# EAGLE design final v1 (EAGLE 7.7.0)
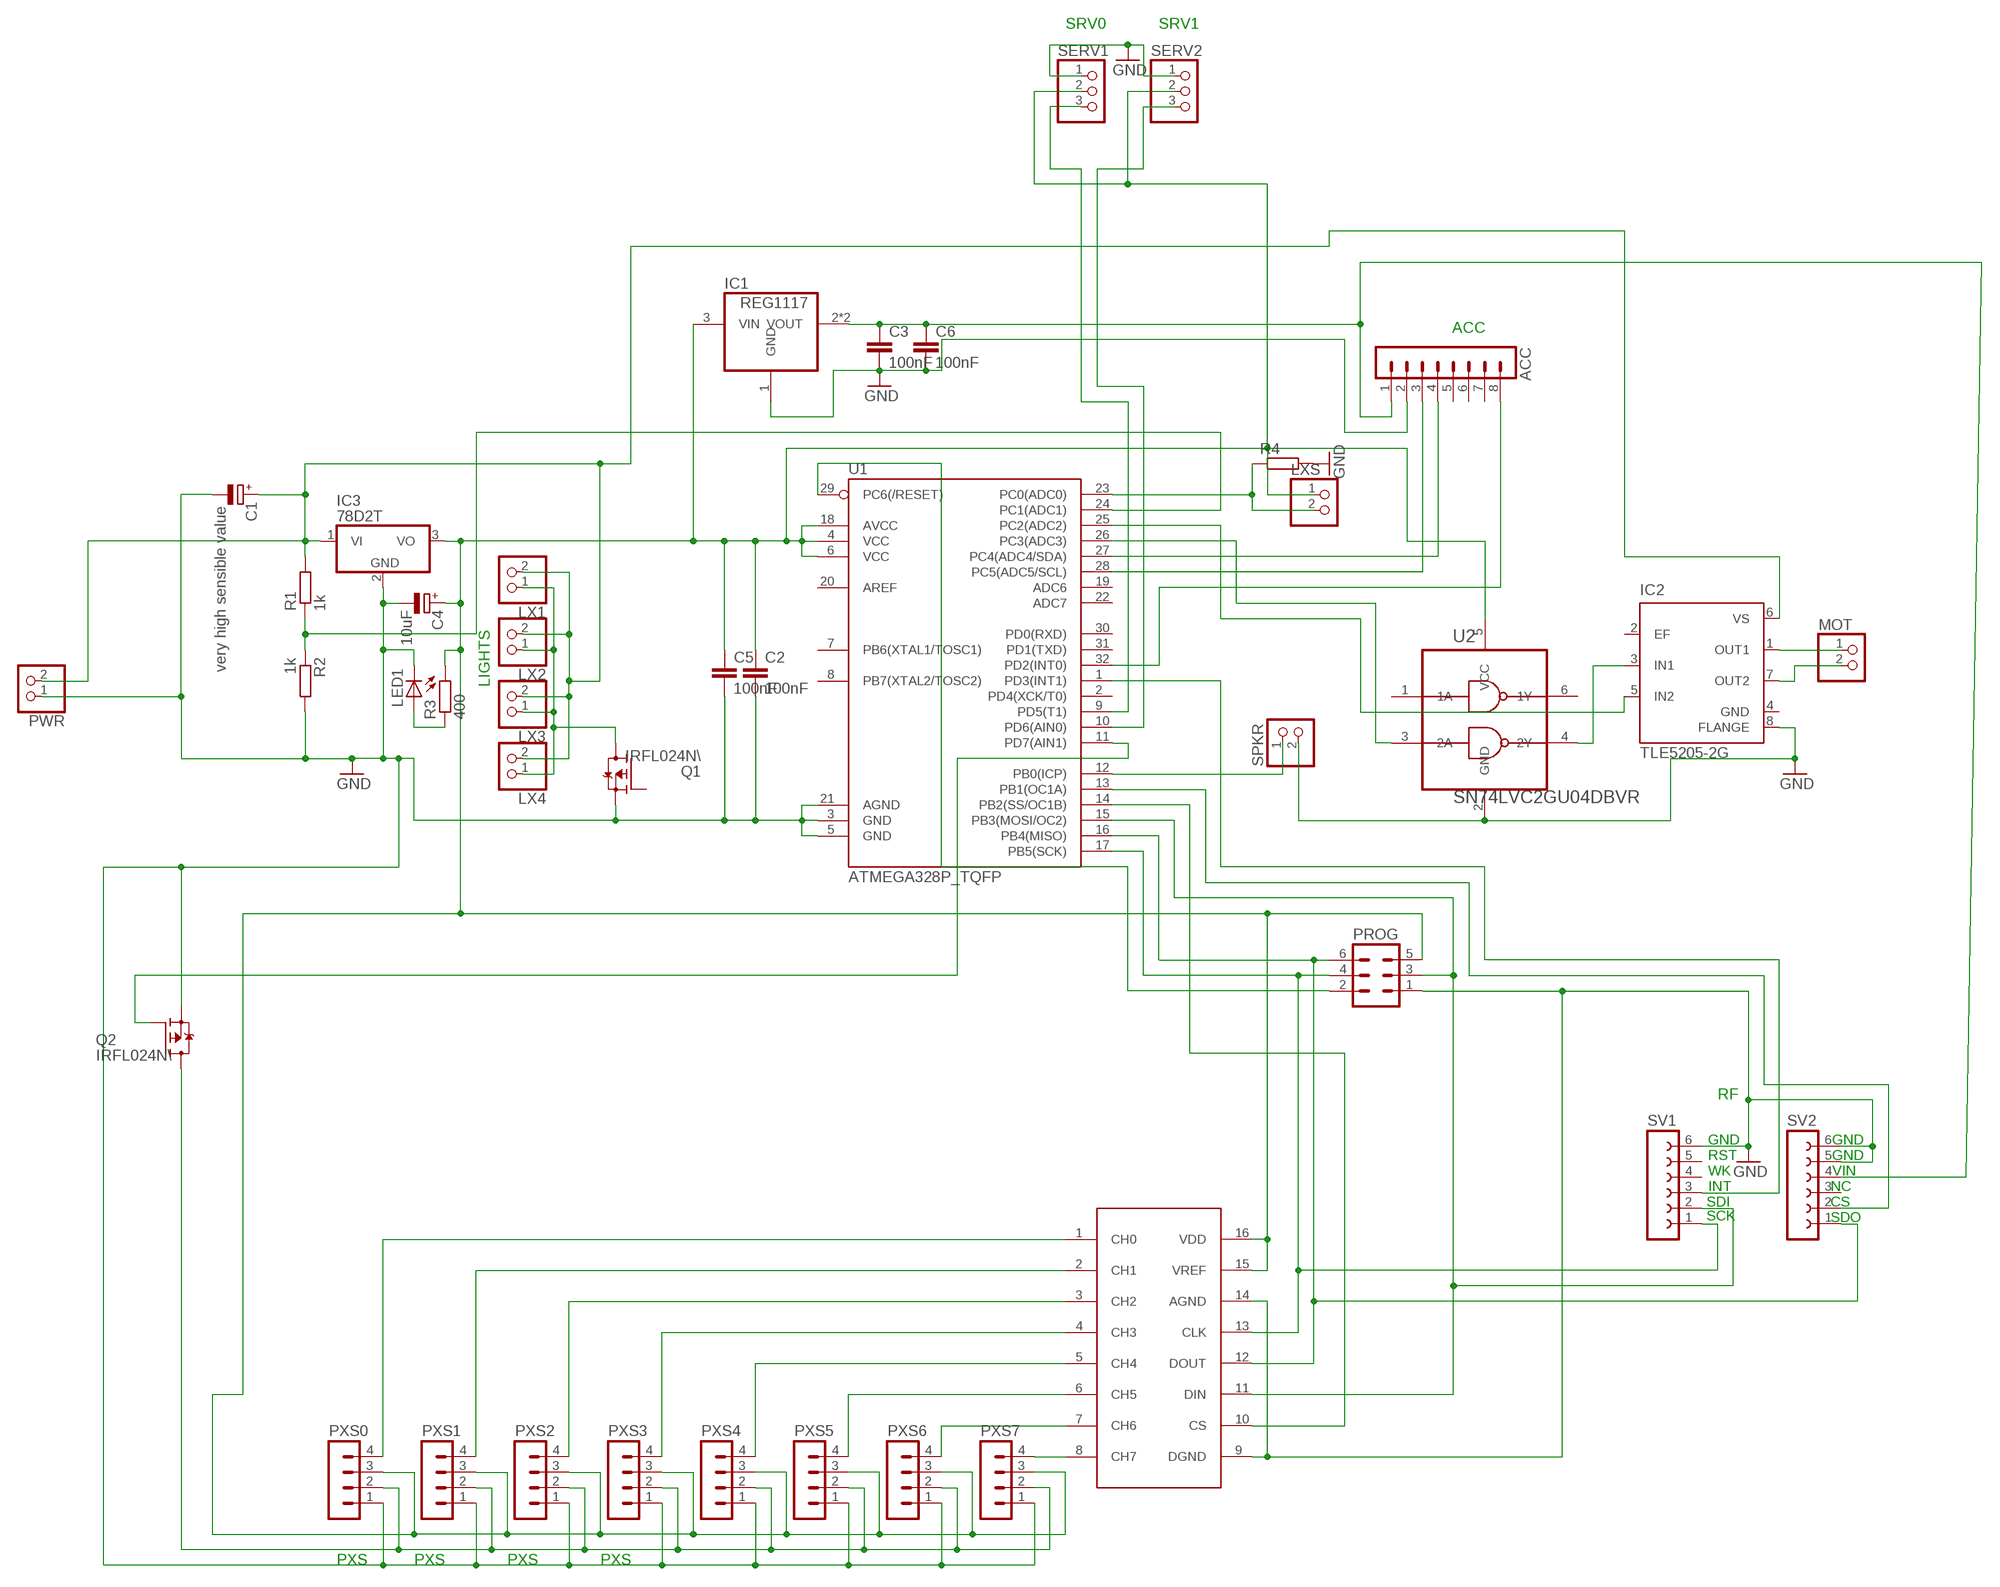
[diagram p0: schematic, sheet 1]

## Parts
ACC  MA08-1  [MA08-1]
C1  very high sensible value  CPOL-EUE2.5-7  [E2,5-7]
C2  100nF  C-EUC1206  [C1206]
C3  100nF  C-EUC1206  [C1206]
C4  10uF  CPOL-EU153CLV-0505  [153CLV-0505]
C5  100nF  C-EUC1206  [C1206]
C6  100nF  C-EUC1206  [C1206]
IC1  REG1117  [SOT223]
IC2  TLE5205-2G  [P-TO263-7-1]
IC3  78D2T  [D2PACK]
LED1  LEDCHIPLED_0603  [CHIPLED_0603]
LX1  PINHD-1X2  [1X02]
LX2  PINHD-1X2  [1X02]
LX3  PINHD-1X2  [1X02]
LX4  PINHD-1X2  [1X02]
LXS  PINHD-1X2  [1X02]
MOT  PINHD-1X2  [1X02]
PROG  MA03-2  [MA03-2]
PWR  PINHD-1X2  [1X02]
PXS0  MA04-1  [MA04-1]
PXS1  MA04-1  [MA04-1]
PXS2  MA04-1  [MA04-1]
PXS3  MA04-1  [MA04-1]
PXS4  MA04-1  [MA04-1]
PXS5  MA04-1  [MA04-1]
PXS6  MA04-1  [MA04-1]
PXS7  MA04-1  [MA04-1]
Q1  IRFL024N\  BSP170P  [SOT223]
Q2  IRFL024N\  BSP170P  [SOT223]
R1  1k  R-EU_M1206  [M1206]
R2  1k  R-EU_R1206  [R1206]
R3  400  R-EU_R0603  [R0603]
R4  R-EU_M1206  [M1206]
SERV1  PINHD-1X3  [1X03]
SERV2  PINHD-1X3  [1X03]
SPKR  PINHD-1X2  [1X02]
SV1  FE06-1  [FE06]
SV2  FE06-1  [FE06]
U1  ATMEGA328P_TQFP  [TQFP32-08]
U2  SN74LVC2GU04DBVR  [SOT95P280X145-6N]
U$3  MCP3208  [SO-16]

## Nets
GND: ACC.2 C1.- C2.2 C3.2 C4.- C5.2 C6.2 IC1.1(GND) IC2.8(FLANGE) IC3.2(GND) LED1.C PROG.1 PWR.1 PXS0.1 PXS1.1 PXS2.1 PXS3.1 PXS4.1 PXS5.1 PXS6.1 PXS7.1 Q1.3(S) Q2.3(S) R2.2 R4.2 SERV1.1 SERV2.1 SPKR.2 SV1.6 SV2.5 SV2.6 U1.3(GND) U1.5(GND) U1.21(AGND) U2.2(GND) U$3.9(DGND) U$3.14(AGND)
MISO: PROG.6 SV2.1 U1.16(PB4(MISO)) U$3.12(DOUT)
MOSI: PROG.3 SV1.2 U1.15(PB3(MOSI/OC2)) U$3.11(DIN)
N$1: SPKR.1 U1.12(PB0(ICP))
N$2: LX1.1 LX2.1 LX3.1 LX4.1 Q1.2(D) Q1.4(D)
N$3: U1.14(PB2(SS/OC1B)) U$3.10(CS)
N$5: ACC.8 U1.32(PD2(INT0))
N$6: PXS7.4 U$3.8(CH7)
N$7: IC2.1(OUT1) MOT.1
N$8: PXS6.4 U$3.7(CH6)
N$9: PXS5.4 U$3.6(CH5)
N$10: SV2.2 U1.13(PB1(OC1A))
N$11: PXS4.4 U$3.5(CH4)
N$12: PXS3.4 U$3.4(CH3)
N$13: PXS2.4 U$3.3(CH2)
N$14: PXS1.4 U$3.2(CH1)
N$15: SV1.3 U1.1(PD3(INT1))
N$16: PXS0.4 U$3.1(CH0)
N$17: ACC.3 U1.28(PC5(ADC5/SCL))
N$18: LXS.2 R4.1 U1.23(PC0(ADC0))
N$19: Q2.1(G) U1.11(PD7(AIN1))
N$20: PXS0.2 PXS1.2 PXS2.2 PXS3.2 PXS4.2 PXS5.2 PXS6.2 PXS7.2 Q2.2(D) Q2.4(D)
N$21: ACC.4 U1.27(PC4(ADC4/SDA))
N$22: IC2.7(OUT2) MOT.2
N$23: IC2.3(IN1) U2.4(2Y)
N$24: U1.26(PC3(ADC3)) U2.3(2A)
N$25: IC2.5(IN2) U1.25(PC2(ADC2))
N$26: LED1.A R3.1
N$31: SERV1.3 U1.9(PD5(T1))
N$34: SERV2.3 U1.10(PD6(AIN0))
RST: PROG.2 U1.29(PC6(/RESET))
SCK: PROG.4 SV1.1 U1.17(PB5(SCK)) U$3.13(CLK)
VBATT: R1.1 R2.1 U1.24(PC1(ADC1))
VCC: C2.1 C4.+ C5.1 IC1.3(VIN) IC3.3(VO) LXS.1 PROG.5 PXS0.3 PXS1.3 PXS2.3 PXS3.3 PXS4.3 PXS5.3 PXS6.3 PXS7.3 R3.2 SERV1.2 SERV2.2 U1.4(VCC) U1.6(VCC) U1.18(AVCC) U2.5(VCC) U$3.15(VREF) U$3.16(VDD)
VCC2: ACC.1 C3.1 C6.1 IC1.2(VOUT) IC1.4(VOUT) SV2.4
VSS: C1.+ IC2.6(VS) IC3.1(VI) LX1.2 LX2.2 LX3.2 LX4.2 PWR.2 R1.2
Unconnected: ACC.5 ACC.6 ACC.7 IC2.2(EF) Q1.1(G) SV1.4 SV1.5 SV2.3 U1.2(PD4(XCK/T0)) U1.7(PB6(XTAL1/TOSC1)) U1.8(PB7(XTAL2/TOSC2)) U1.19(ADC6) U1.20(AREF) U1.22(ADC7) U1.30(PD0(RXD)) U1.31(PD1(TXD)) U2.1(1A) U2.6(1Y)

## Notes on the sheet
- SRV0 | SRV1
- ACC
- LIGHTS
- RF
- GND | GND
- RST | GND
- WK | VIN
- INT | NC
- SDI | CS
- SCK | SDO
- PXS | PXS | PXS | PXS

## Power pins joined to a net without a drawn wire
GND: IC2.4(GND)

## Library data of the parts
ACC = con-lstb:MA08-1: PIN HEADER; OC_FARNELL: unknown; OC_NEWARK: unknown
C1 C4 = rcl:CPOL-EU: POLARIZED CAPACITOR, European symbol
C2 C3 C5 C6 = rcl:C-EU: CAPACITOR, European symbol
IC1 = burr-brown:REG1117: 800mA and 1A Low Dropout (LDO) Positive Regulator 1.8V, 2.5V, 2.85V, 3.3V, 5V, and Adj; MPN: REG1117; OC_FARNELL: 1097566; OC_NEWARK: 14P6981
IC2 = infineon:TLE5205-2: 5-A H-Bridge for DC-Motor Applications Source: http://www.infineon.com .. tle5205-2.pdf; OC_FARNELL: unknown; OC_NEWARK: unknown
IC3 = custom:78*: Positive VOLTAGE REGULATOR Source: http://cache.national.com/ds/LM/LM78L05.pdf http://www.fairchildsemi.com/ds/LM/LM7805.pdf
LED1 = led:LED: LED OSRAM: - CHIPLED LG R971, LG N971, LY N971, LG Q971, LY Q971, LO R971, LY R971 LH N974, LH R974 LS Q976, LO Q976, LY Q976 LO Q996 - Hyper CHIPLED LW Q18S LB Q993, LB Q99A, LB R99A - SideLED LS A670, LO A670, LY A670, LG A670, LP A670 LB A673, LV A673, LT A673, LW A673 LH A674 LY A675 LS A676, LA A676, LO A676, LY A676, LW A676 LS A679, LY A679, LG A679 - Hyper Micro SIDELED® LS Y876, LA Y876, LO Y876, LY Y876 LT Y87S - SmartLED LW L88C, LW L88S LB L89C, LB L89S, LG L890 LS L89K, LO L89K, LY L89K LS L896, LA L896, LO L896, LY L896 - TOPLED LS T670, LO T670, LY T670, LG T670, LP T670 LSG T670, LSP T670, LSY T670, LOP T670, LYG T670 LG T671, LOG T671, LSG T671 LB T673, LV T673, LT T673, LW T673 LH T674 LS T676, LA T676, LO T676, LY T676, LB T676, LH T676, LSB T676, LW T676 LB T67C, LV T67C, LT T67C, LS T67K, LO T67K, LY T67K, LW E67C LS E67B, LA E67B, LO E67B, LY E67B, LB E67C, LV E67C, LT E67C LW T67C LS T679, LY T679, LG T679 LS T770, LO T770, LY T770, LG T770, LP T770 LB T773, LV T773, LT T773, LW T773 LH T774 LS E675, LA E675, LY E675, LS T675 LS T776, LA T776, LO T776, LY T776, LB T776 LHGB T686 LT T68C, LB T68C - Hyper Mini TOPLED® LB M676 - Mini TOPLED Santana® LG M470 LS M47K, LO M47K, LY M47K Source: http://www.osram.convergy.de LUXEON: - LUMILED® LXK2-PW12-R00, LXK2-PW12-S00, LXK2-PW14-U00, LXK2-PW14-V00 LXK2-PM12-R00, LXK2-PM12-S00, LXK2-PM14-U00 LXK2-PE12-Q00, LXK2-PE12-R00, LXK2-PE12-S00, LXK2-PE14-T00, LXK2-PE14-U00 LXK2-PB12-K00, LXK2-PB12-L00, LXK2-PB12-M00, LXK2-PB14-N00, LXK2-PB14-P00, LXK2-PB14-Q00 LXK2-PR12-L00, LXK2-PR12-M00, LXK2-PR14-Q00, LXK2-PR14-R00 LXK2-PD12-Q00, LXK2-PD12-R00, LXK2-PD12-S00 LXK2-PH12-R00, LXK2-PH12-S00 LXK2-PL12-P00, LXK2-PL12-Q00, LXK2-PL12-R00 Source: www.luxeon.com KINGBRIGHT: KA-3528ASYC Source: www.kingbright.com
LX1-LX4 LXS MOT PWR SPKR = pinhead:PINHD-1X2: PIN HEADER
PROG = con-lstb:MA03-2: PIN HEADER; OC_FARNELL: unknown; OC_NEWARK: unknown
PXS0 PXS1-PXS7 = custom:MA04-1: PIN HEADER; OC_FARNELL: unknown; OC_NEWARK: unknown
Q1 Q2 = transistor-fet:BSP170P: SIPMOS(R) Small-Signal-Transistor P-Channel, Enhancement mode Source: http://www.infineon.com/upload/Document/BSP170P_Rev2.4.pdf
R1-R4 = resistor:R-EU_: RESISTOR, European symbol
SERV1 SERV2 = pinhead:PINHD-1X3: PIN HEADER
SV1 SV2 = con-lsta:FE06-1: FEMALE HEADER; OC_FARNELL: unknown; OC_NEWARK: unknown
U1 = SparkFun-IC-Microcontroller:ATMEGA328P_TQFP: Popular 328P in QFP Storefront component: ATmega328 - TQFP <https://www.sparkfun.com/products/13448> (COM-13448) Datasheet <http://www.sparkfun.com/datasheets/Components/SMD/ATMega328.pdf> SparkFun Products SparkFun RedBoard - Programmed with Arduino <https://www.sparkfun.com/products/12757> (DEV-12757) Arduino Pro Mini 328 - 5V/16MHz <https://www.sparkfun.com/products/11113> (DEV-11113) Arduino Pro Mini 328 - 3.3V/8MHz <https://www.sparkfun.com/products/11114> (DEV-11114) SparkFun OpenLog <https://www.sparkfun.com/products/13712> (DEV-13712) SparkFun MicroView - OLED Arduino Module <https://www.sparkfun.com/products/12923> (DEV-12923) SparkFun Digital Sandbox <https://www.sparkfun.com/products/12651> (DEV-12651) SparkFun PicoBoard <https://www.sparkfun.com/products/11888> (WIG-11888) Arduino Fio <https://www.sparkfun.com/products/10116> (DEV-10116) LilyPad Arduino 328 Main Board <https://www.sparkfun.com/products/13342> (DEV-13342) SparkFun RedStick <https://www.sparkfun.com/products/13741> (DEV-13741) LilyPad MP3 <https://www.sparkfun.com/products/11013> (DEV-11013) LilyPad Arduino SimpleSnap <https://www.sparkfun.com/products/10941> (DEV-10941) SparkFun Stepoko <https://www.sparkfun.com/products/13899> (ROB-13899) SparkFun Geiger Counter <https://www.sparkfun.com/products/11345> (SEN-11345) SparkFun EL Sequencer <https://www.sparkfun.com/products/12781> (COM-12781) Arduino Pro 328 - 5V/16MHz <https://www.sparkfun.com/products/10915> (DEV-10915) CryptoCape <https://www.sparkfun.com/products/12773> (DEV-12773) SparkFun IR Thermometer Evaluation Board - MLX90614 <https://www.sparkfun.com/products/10740> (SEN-10740) SparkFun RedBot Mainboard <https://www.sparkfun.com/products/12097> (ROB-12097) Arduino Pro 328 - 3.3V/8MHz <https://www.sparkfun.com/products/10914> (DEV-10914) SparkFun Block for Intel® Edison - Arduino <https://www.sparkfun.com/products/13036> (DEV-13036) SparkFun Simon Says - Surface Mount Soldering Kit <https://www.sparkfun.com/products/10935> (KIT-10935) SparkFun 7-Segment Serial Display - Red <https://www.sparkfun.com/products/11441> (COM-11441) SparkFun 7-Segment Serial Display - White <https://www.sparkfun.com/products/11629> (COM-11629) SparkFun 7-Segment Serial Display - Yellow <https://www.sparkfun.com/products/11443> (COM-11443) SparkFun 7-Segment Serial Display - Kelly Green <https://www.sparkfun.com/products/11440> (COM-11440) SparkFun 7-Segment Serial Display - Blue <https://www.sparkfun.com/products/11442> (COM-11442) SparkFun OpenSegment Serial Display - 20mm (Blue) <https://www.sparkfun.com/products/11647> (COM-11647) SparkFun OpenSegment Serial Display - 20mm (Green) <https://www.sparkfun.com/products/11646> (COM-11646) SparkFun OpenSegment Serial Display - 20mm (White) <https://www.sparkfun.com/products/11648> (COM-11648) SparkFun OpenSegment Serial Display - 20mm (Red) <https://www.sparkfun.com/products/11644> (COM-11644) SparkFun OpenSegment Serial Display - 20mm (Yellow) <https://www.sparkfun.com/products/11645> (COM-11645) SparkFun OpenSegment Shield <https://www.sparkfun.com/products/13190> (DEV-13190); PROD_ID: IC-09069
U2 = custom:SN74LVC2GU04: DUAL INVERTER GATE; MPN: SN74LVC2GU04DBVR; OC_FARNELL: -; OC_NEWARK: 76C4185; PACKAGE: SOT-23-6; SUPPLIER: TEXAS INSTRUMENTS
U$3 = custom:MCP3208

## Board
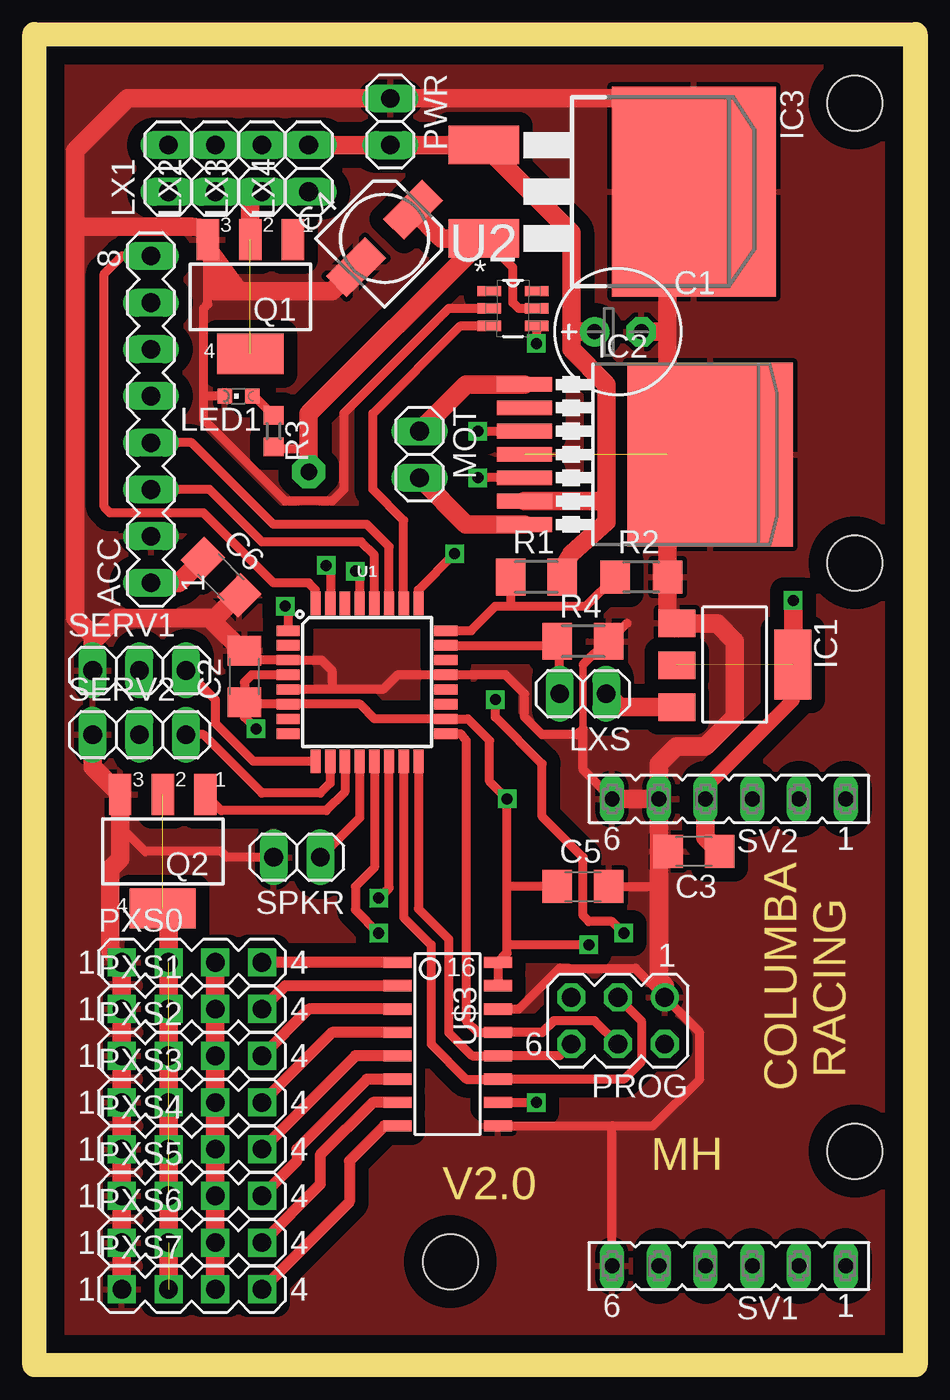
[diagram p1: board, top side]
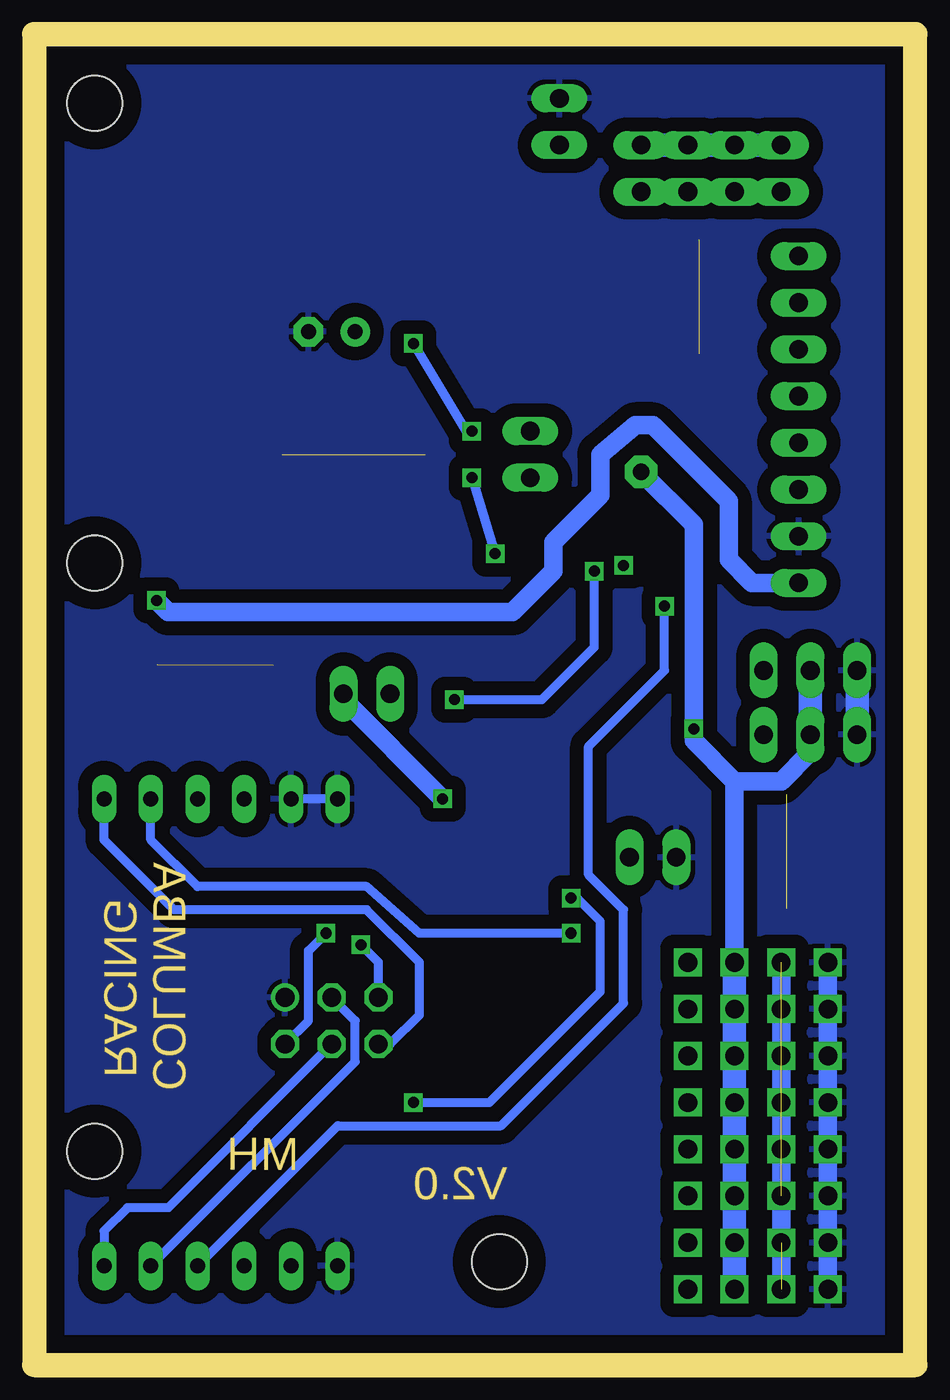
[diagram p2: board, bottom side, seen from below]

Size 46.66 x 71.11 mm. Coordinates in mm from the lower left corner, seen from the top.
Outline: 0,0 46.66,0 46.66,71.11 0,71.11 0,0
Copper layers (1*16): Top 0.035mm / dielectric 1.5mm / Bottom 0.035mm
Design rules "default": minimum track width 10mil, minimum drill 24mil, track to track 8mil, track to pad 8mil, pad to pad 8mil, via to via 8mil, smd to smd 8mil, copper to edge 40mil, drill to drill 8mil, minimum pad ring 10mil, minimum via ring 8mil, stop-mask expansion 4mil, vias tented up to drill 0mil, thermal gap 10mil
Holes 3 mm at 44,68 44,43 44,11 22,5
Milling: 4 lines

### Footprints (pad centres in the part's own frame; a part is rotated, then mirrored left to right if it is on the bottom)
MA08-1 = drill 1.016 long: 1 -8.89,0; 2 -6.35,0; 3 -3.81,0; 4 -1.27,0; 5 1.27,0; 6 3.81,0; 7 6.35,0; 8 8.89,0
E2,5-7 = drill 0.813 pad 1.6: + -1.27,0 | drill 0.813 pad 1.6 octagon: - 1.27,0
C1206 = smd 1.6 x 1.8: 1 -1.4,0; 2 1.4,0
153CLV-0505 = smd 3 x 1.6: + 2.2,0; - -2.2,0
SOT223 = smd 1.499 x 2.007: 1 -2.261,-3.15; 2 0.025,-3.15; 3 2.311,-3.15 | smd 3.81 x 2.007: 4 0,3.15
P-TO263-7-1 = smd 0.8 x 3: 1 -3.81,-9.207; 2 -2.54,-9.207; 3 -1.27,-9.207; 4 0,-9.207; 5 1.27,-9.207; 6 2.54,-9.207; 7 3.81,-9.207 | smd 10 x 9: 8 0,0.895
D2PACK = smd 2.083 x 3.81: 1 -2.54,-8.89; 3 2.54,-8.89 | smd 11.43 x 8.89: 2 0,2.54
CHIPLED_0603 = smd 0.8 x 0.8: A 0,-0.75; C 0,0.75
1X02 = drill 1.016 long: 1 -1.27,0; 2 1.27,0
MA03-2 = drill 1.016: 1 -2.54,-1.27 | drill 1.016 octagon: 2 -2.54,1.27; 3 0,-1.27; 4 0,1.27; 5 2.54,-1.27; 6 2.54,1.27
MA04-1 = drill 1.016 square: 1 -3.81,0; 2 -1.27,0; 3 1.27,0; 4 3.81,0
SOT223' = smd 1.219 x 2.235: 1 -2.311,-3.099; 2 0,-3.099; 3 2.311,-3.099 | smd 3.6 x 2.2: 4 0,3.099
M1206 = smd 1.6 x 2: 1 -1.4,0; 2 1.4,0
R1206 = smd 1.6 x 1.803: 1 -1.422,0; 2 1.422,0
R0603 = smd 1 x 1.1: 1 -0.85,0; 2 0.85,0
1X03 = drill 1.016 long: 1 -2.54,0; 2 0,0; 3 2.54,0
FE06 = drill 0.813 long: 1 -6.35,0; 2 -3.81,0; 3 -1.27,0; 4 1.27,0; 5 3.81,0; 6 6.35,0
TQFP32-08 = smd 1.27 x 0.559: 1 -4.293,2.8; 2 -4.293,2; 3 -4.293,1.2; 4 -4.293,0.4; 5 -4.293,-0.4; 6 -4.293,-1.2; 7 -4.293,-2; 8 -4.293,-2.8; 17 4.293,-2.8; 18 4.293,-2; 19 4.293,-1.2; 20 4.293,-0.4; 21 4.293,0.4; 22 4.293,1.2; 23 4.293,2; 24 4.293,2.8 | smd 0.559 x 1.27: 9 -2.8,-4.293; 10 -2,-4.293; 11 -1.2,-4.293; 12 -0.4,-4.293; 13 0.4,-4.293; 14 1.2,-4.293; 15 2,-4.293; 16 2.8,-4.293; 25 2.8,4.293; 26 2,4.293; 27 1.2,4.293; 28 0.4,4.293; 29 -0.4,4.293; 30 -1.2,4.293; 31 -2,4.293; 32 -2.8,4.293
SOT95P280X145-6N = smd 1.27 x 0.559: 1 -1.295,0.94; 2 -1.295,0; 3 -1.295,-0.94; 4 1.295,-0.94; 5 1.295,0; 6 1.295,0.94
SO-16 = smd 0.61 x 1.524: 1 -4.445,-2.794; 2 -3.175,-2.794; 3 -1.905,-2.794; 4 -0.635,-2.794; 5 0.635,-2.794; 6 1.905,-2.794; 7 3.175,-2.794; 8 4.445,-2.794; 9 4.445,2.667; 10 3.175,2.667; 11 1.905,2.667; 12 0.635,2.667; 13 -0.635,2.667; 14 -1.905,2.667; 15 -3.175,2.667; 16 -4.445,2.667

### Placement (x,y rotation side)
ACC  5.71,50.8 90 top
C1  31.11,55.56 0 top
C2  10.79,36.83 90 top
C3  35.24,27.3 180 top
C4  18.41,60.64 45 top
C5  29.21,25.4 0 top
C6  9.53,42.23 315 top
IC1  37.47,37.47 270 top
IC2  35.24,48.9 270 top
IC3  32.7,63.18 270 top
LED1  10.48,52.07 90 top
LX1  6.67,64.45 90 top
LX2  9.21,64.45 90 top
LX3  11.75,64.45 90 top
LX4  14.29,64.45 90 top
LXS  29.21,35.88 180 top
MOT  20.32,48.9 270 top
PROG  31.11,18.1 180 top
PWR  18.73,66.99 270 top
PXS0  7.94,21.27 0 top
PXS1  7.94,18.73 0 top
PXS2  7.94,16.19 0 top
PXS3  7.94,13.65 0 top
PXS4  7.94,11.11 0 top
PXS5  7.94,8.57 0 top
PXS6  7.94,6.03 0 top
PXS7  7.94,3.49 0 top
Q1  IRFL024N\  [SOT223']  11.11,57.47 180 top
Q2  IRFL024N\  [SOT223']  6.35,27.3 180 top
R1  26.67,42.23 0 top
R2  32.38,42.23 0 top
R3  12.38,50.16 270 top
R4  1k  [M1206]  29.21,38.73 0 top
SERV1  5.08,37.15 0 top
SERV2  5.08,33.66 0 top
SPKR  13.65,26.99 180 top
SV1  37.15,4.76 180 top
SV2  37.15,30.16 180 top
U1  17.46,36.51 0 top
U2  25.4,56.83 0 top
U$3  21.91,16.83 270 top

### Tracks (layer width: path | path; a pad name or v marks a point on that pad's centre or on a via)
GND  (1 unrouted)
  Top 0.4: 29.21,37.47 29.21,33.97
  Top 0.5: U$3.9 30.8,12.38 | 30.8,12.38 33.02,12.38 35.56,14.92 35.56,17.46 PROG.1 32.07,20.95 27.94,20.95 25.72,18.73 U$3.14 | 15.56,36.11 18.33,36.11 19.13,36.91 U1.21 25,36.91 26.04,35.88 26.04,34.61 26.99,33.66 28.89,33.66 29.21,33.97 29.21,31.75 SV2.6 | 15.56,36.11 U1.5 | 15.56,36.11 15.56,37.15 14.99,37.71 U1.3 10.68,37.71 C2.2 | 31.6,39.73 R4.2 30.48,38.73 29.21,37.47 | SV1.6 30.8,12.38 | SPKR.2 9.84,26.99 9.53,27.3 5.4,27.3 4.13,28.57 4.13,30.32 Q2.3 | IC2.8 33.81,48.9 | U2.2 21.91,56.83 16.19,51.12 16.19,46.99 15.56,46.35 13.02,46.35 8.57,50.8 8.57,52.07 | 8.57,52.07 8.57,56.83 8.8,57.06 8.8,60.1 | C5.2 33.02,25.4 33.34,25.08 | LED1.C 8.57,52.07 | IC1.1 34.35,39.69
  Top 0.75: 1.91,61.28 1.59,60.96
  Top 1: SV2.6 SV2.5 | 33.81,55.56 33.81,61.75 IC3.2 34.29,62.55 34.29,63.82 31.11,68.26 PWR.1 4.45,68.26 1.59,65.41 1.59,60.96 1.59,40.01 2.54,39.05 2.54,38.73 | 33.81,55.56 33.81,48.9 R2.2 33.81,40.23 | SV2.5 33.34,25.08 33.34,20.32 33.66,20 PROG.1 | 34.29,39.69 36.51,39.69 37.47,38.73 37.47,34.61 35.88,33.02 34.29,33.02 33.34,32.07 SV2.5 | SERV1.1 2.54,38.73 | 2.54,38.73 3.81,40.01 8.89,40.01 9.05,39.85 | 9.05,39.85 10.79,38.1 | SERV2.1 2.54,31.9 Q2.3 4.04,26.9 3.49,26.35 3.49,21.91 PXS0.1 PXS7.1 | 1.91,61.28 7.94,61.28 8.65,61.2 Q1.3 8.8,60.1 10.48,57.78 | C4.- 15.56,57.78 10.48,57.78 | C1.- 33.81,55.56 | 10.48,57.78 9.21,57.78 9.21,58.42 | 10.44,41.24 9.05,39.85
  Bottom 0.5: SV2.6 SV2.5
  Bottom 1: PXS7.1 PXS0.1
  Bottom 1.27: SERV1.1 SERV2.1
  pour Bottom (isolate 0.75): 0,71.12 46.67,71.12 46.67,0 0,0
  pour Top (isolate 0.75): 0,71.12 46.67,71.12 46.67,0 0,0
MISO
  Top 0.5: U1.16 20.26,24.19 21.91,22.54 21.91,17.46 23.18,16.19 U$3.12 27.94,16.19 PROG.6
  Bottom 0.5: PROG.6 27.94,16.83 26.35,18.41 26.35,21.27 29.21,24.13 39.69,24.13 43.5,27.94 SV2.1
MOSI
  Top 0.5: U1.15 19.46,23.72 20.95,22.23 20.95,16.83 22.86,14.92 U$3.11 31.43,14.92 32.38,15.88 32.38,18.1 PROG.3
  Bottom 0.5: SV1.2 29.84,15.88 29.84,18.1 PROG.3
N$1
  Top 0.5: U1.12 17.06,29.13 SPKR.1
N$2  (1 unrouted)
  Top 1: LX2.1 LX1.1 11.11,63.18 | LX4.1 LX3.1 11.11,63.18 | Q1.2 11.11,63.18
  Bottom 1: LX4.1 LX3.1 LX2.1 LX1.1
N$3  (via drill 0.6)
  Top 0.5: U$3.10 v26.67,13.65 | v18.1,24.77 18.66,25.33 U1.14
  Bottom 0.5: v26.67,13.65 22.54,13.65 16.51,19.68 16.51,23.5 17.78,24.77 v18.1,24.77
N$5
  Top 0.5: U1.32 14.66,41.53 14.29,41.91 12.38,41.91 8.57,45.72 3.49,45.72 3.17,46.04 3.17,58.74 4.13,59.69 ACC.8
N$6
  Top 0.6: U$3.8 18.41,12.38 16.51,10.48 16.51,8.26 PXS7.4
N$7
  Top 1: IC2.1 22.86,52.7 MOT.1
N$8
  Top 0.6: U$3.7 17.78,13.65 14.92,10.79 14.92,9.21 PXS6.4
N$9
  Top 0.6: U$3.6 17.46,14.92 13.65,11.11 13.65,10.48 PXS5.4
N$10  (via drill 0.6)
  Top 0.5: U1.13 17.86,26.43 16.83,25.4 16.83,24.13 v18.1,22.86
  Bottom 0.5: v18.1,22.86 26.35,22.86 29.21,25.4 38.42,25.4 40.96,27.94 SV2.2
N$11
  Top 0.6: U$3.5 16.83,16.19 PXS4.4
N$12
  Top 0.6: U$3.4 15.56,17.46 PXS3.4
N$13
  Top 0.6: U$3.3 14.29,18.73 PXS2.4
N$14
  Top 0.6: U$3.2 13.02,20 PXS1.4
N$15  (via drill 0.6)
  Top 0.5: v13.02,40.64 13.17,40.49 U1.1
  Bottom 0.5: v13.02,40.64 13.02,37.15 17.14,33.02 17.14,26.04 15.24,24.13 15.24,19.05 21.91,12.38 30.8,12.38 SV1.3
N$16
  Top 0.6: U$3.1 PXS0.4
N$17
  Top 0.5: U1.28 17.86,43.41 17.14,44.13 11.75,44.13 8.89,46.99 ACC.3
N$18
  Top 0.5: LXS.2 27.94,38.6 R4.1 | 27.49,39.05 R4.1 | U1.23 27.59,38.51 R4.1
N$19
  Top 0.5: U1.11 16.26,30.55 15.24,29.53 9.54,29.53 Q2.1
N$20  (7 unrouted)
  Top 1: Q2.4 6.67,23.89 PXS0.2 PXS7.2
  Bottom 1: PXS0.2 PXS7.2
N$21
  Top 0.5: U1.27 18.66,43.88 17.46,45.09 12.38,45.09 7.94,49.53 ACC.4
N$22
  Top 1: IC2.7 22.86,45.09 MOT.2
N$23  (via drill 0.6)
  Top 0.5: U2.4 26.67,55.87 v26.67,54.93 | v23.5,50.16 IC2.3
  Bottom 0.5: v26.67,54.93 23.81,50.16 v23.5,50.16
N$24
  Top 0.5: U1.26 19.46,45.31 17.78,46.99 17.78,51.12 22.55,55.89 U2.3
N$25  (via drill 0.6)
  Top 0.5: IC2.5 v23.5,47.62 | v22.23,43.5 20.26,41.53 U1.25
  Bottom 0.5: v23.5,47.62 v22.23,43.5
N$26
  Top 0.5: R3.1 11.33,52.07 LED1.A
N$27  (via drill 0.6)
  other vias: 15.24,42.86
N$28
  Top 0.5: 15.25,42.85 15.47,42.6 15.47,40.65
N$31
  Top 0.5: SERV1.3 9.21,35.56 9.21,34.29 11.28,32.22 U1.9
N$34
  Top 0.5: U1.10 15.46,31.02 14.92,30.48 11.75,30.48 8.57,33.66 SERV2.3
RST  (via drill 0.6)
  Top 0.5: v16.83,42.55 17.06,42.31 U1.29 | v24.45,35.56 24.45,34.61 26.99,32.07 26.99,29.21 29.21,26.99 29.21,23.81 29.53,23.5 30.8,23.5 v31.43,22.86
  Bottom 0.5: PROG.2 32.38,18.1 32.38,21.91 v31.43,22.86 | v16.83,42.55 16.83,38.42 19.68,35.56 v24.45,35.56
SCK
  Top 0.5: U1.17 22.54,33.71 22.86,33.34 22.86,18.1 23.5,17.46 U$3.13 26.99,17.46 27.62,18.1 29.84,18.1 PROG.4
  Bottom 0.5: PROG.4 40.01,7.94 42.23,7.94 43.5,6.67 SV1.1
VBATT
  Top 0.5: R2.1 29.38,40.64 25.4,40.64 | U1.24 23.12,39.31 24.45,40.64 25.4,40.64 | R1.1 25.27,40.77 25.4,40.64
VCC  (via drill 0.6, 0.9 pad 1.78)
  Top 0.5: 25.08,22.23 25.08,21.78 U$3.16 U$3.15 | 25.08,22.23 25.08,25.4 | 25.08,25.4 v25.08,30.16 24.13,31.11 24.13,33.34 22.95,34.51 U1.18 17.88,34.51 17.07,35.31 U1.6 10.91,35.31 C2.1 | v29.53,22.23 25.08,22.23 | U2.5 25.72,56.83 25.4,57.15 25.4,59.05 IC3.3 | v11.43,33.97 10.79,34.61 C2.1 | U1.4 11.2,36.91 10.79,36.51 C2.1 | C5.1 25.08,25.4 | R3.2 12.48,49.21 14.29,49.21
  Top 1: IC1.3 31.2,35.15 LXS.1 | v14.29,47.94 14.29,49.21 14.29,51.12 IC3.3 21.53,60.64 C4.+ | PXS7.3 PXS0.3
  Bottom 0.5: PROG.5 28.57,21.27 v29.53,22.23
  Bottom 1: 9.21,31.11 6.67,31.11 5.08,32.7 SERV2.2 | PXS0.3 9.21,31.11 | 9.21,31.11 11.43,33.34 v11.43,33.97 11.43,45.09 v14.29,47.94 | LXS.1 30.48,35.56 v25.08,30.16
  Bottom 1.27: PXS7.3 PXS6.3 PXS5.3 PXS4.3 PXS3.3 PXS2.3 PXS1.3 PXS0.3 | SERV1.2 SERV2.2
VCC2  (via drill 0.6)  (1 unrouted)
  Top 0.75: IC1.4 40.62,35.53 35.88,30.8 SV2.4
  Top 1: IC1.4 40.64,37.49 v40.64,40.96 | C3.1 35.88,28.07 SV2.4 | C6.1 7.23,41.91 ACC.1
  Bottom 1: v40.64,40.96 40.01,40.32 21.27,40.32 19.05,42.55 19.05,44.13 16.51,46.67 16.51,48.9 14.61,50.48 13.65,50.48 9.53,46.35 9.53,43.18 8.26,41.91 ACC.1
VSS
  Top 1: 28.57,55.56 28.57,60.96 IC3.1 PWR.2 LX4.2 LX1.2 | 28.57,55.56 28.57,54.61 30.48,52.7 30.48,46.35 | 30.48,46.35 IC2.6 | R1.2 28.07,42.67 28.57,43.5 30.48,45.22 30.48,46.35 | C1.+ 28.57,55.56
  Bottom 1.27: LX4.2 LX3.2 LX2.2 LX1.2

### Text on the board
Milling: COLUMBA / RACING | MH | V2.0